# Altium project MLAB_Hazi.PrjPcb
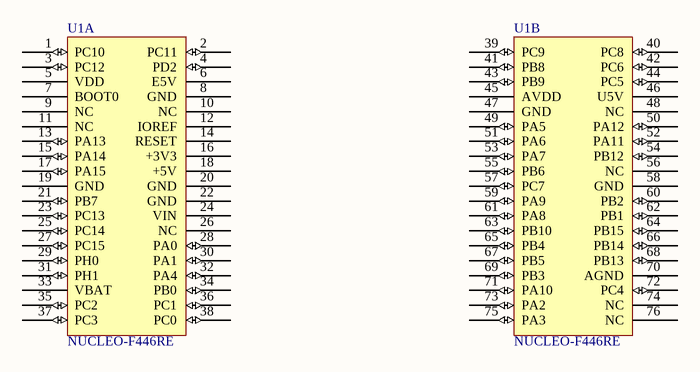
[diagram p0: Nucleo.SchDoc]
1 sheet, 1 parts. Net scope: global (net labels, ports and power ports of the same name join across sheets).
Board file: hazi_kiindulas.PcbDoc

## Sheet Nucleo.SchDoc
size A4; Organization: BME AUT; Address1: Magyar tudósok krt. 2.; Address2: Q épület; Address3: Budapest; Address4: H-1117; DocumentNumber: 1; SheetNumber: 1; SheetTotal: 2

### Parts
U1  NUCLEO-F446RE  [FP_NUCLEO-64]  (parts A,B of 2)

### Nets

Not connected (* = marked no-connect by the designer): U1 1(PC10) 2(PC11) 3(PC12) 4(PD2) 5(VDD) 6(E5V) 7(BOOT0) 8(GND) 9(NC) 10(NC) 11(NC) 12(IOREF) 13(PA13) 14(RESET) 15(PA14) 16(+3V3) 17(PA15) 18(+5V) 19(GND) 20(GND) 21(PB7) 22(GND) 23(PC13) 24(VIN) 25(PC14) 26(NC) 27(PC15) 28(PA0) 29(PH0) 30(PA1) 31(PH1) 32(PA4) 33(VBAT) 34(PB0) 35(PC2) 36(PC1) 37(PC3) 38(PC0) 39(PC9) 40(PC8) 41(PB8) 42(PC6) 43(PB9) 44(PC5) 45(AVDD) 46(U5V) 47(GND) 48(NC) 49(PA5) 50(PA12) 51(PA6) 52(PA11) 53(PA7) 54(PB12) 55(PB6) 56(NC) 57(PC7) 58(GND) 59(PA9) 60(PB2) 61(PA8) 62(PB1) 63(PB10) 64(PB15) 65(PB4) 66(PB14) 67(PB5) 68(PB13) 69(PB3) 70(AGND) 71(PA10) 72(PC4) 73(PA2) 74(NC) 75(PA3) 76(NC)

### Notes on the sheet
- Title
- Size:
- Date:
- A4
- Number:
- Time:
- Revision:
- Sheet
- of
- File:

### Library data of the parts
U1 = NUCLEO-F446RE: Reference: NUCLEO; Name: Nucleo F446RE; Supplier: Tanszék